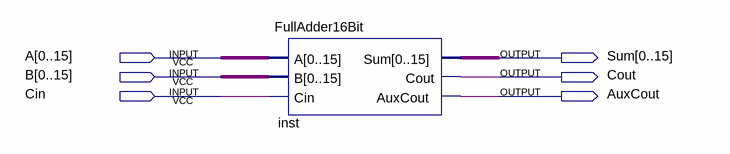
[diagram p0: schematic sheet]
// Quartus schematic ALU.bdf as structural Verilog: 1 symbols, 6 pins
module ALU (
  input  [0:15] A,
  input  [0:15] B,
  input  Cin,
  output [0:15] Sum,
  output Cout,
  output AuxCout
);

  FullAdder16Bit inst (.A(A), .B(B), .Cin(Cin), .Sum(Sum), .Cout(Cout), .AuxCout(AuxCout));
endmodule
